# EAGLE design powerBoard_v4 (EAGLE 6.6.0)
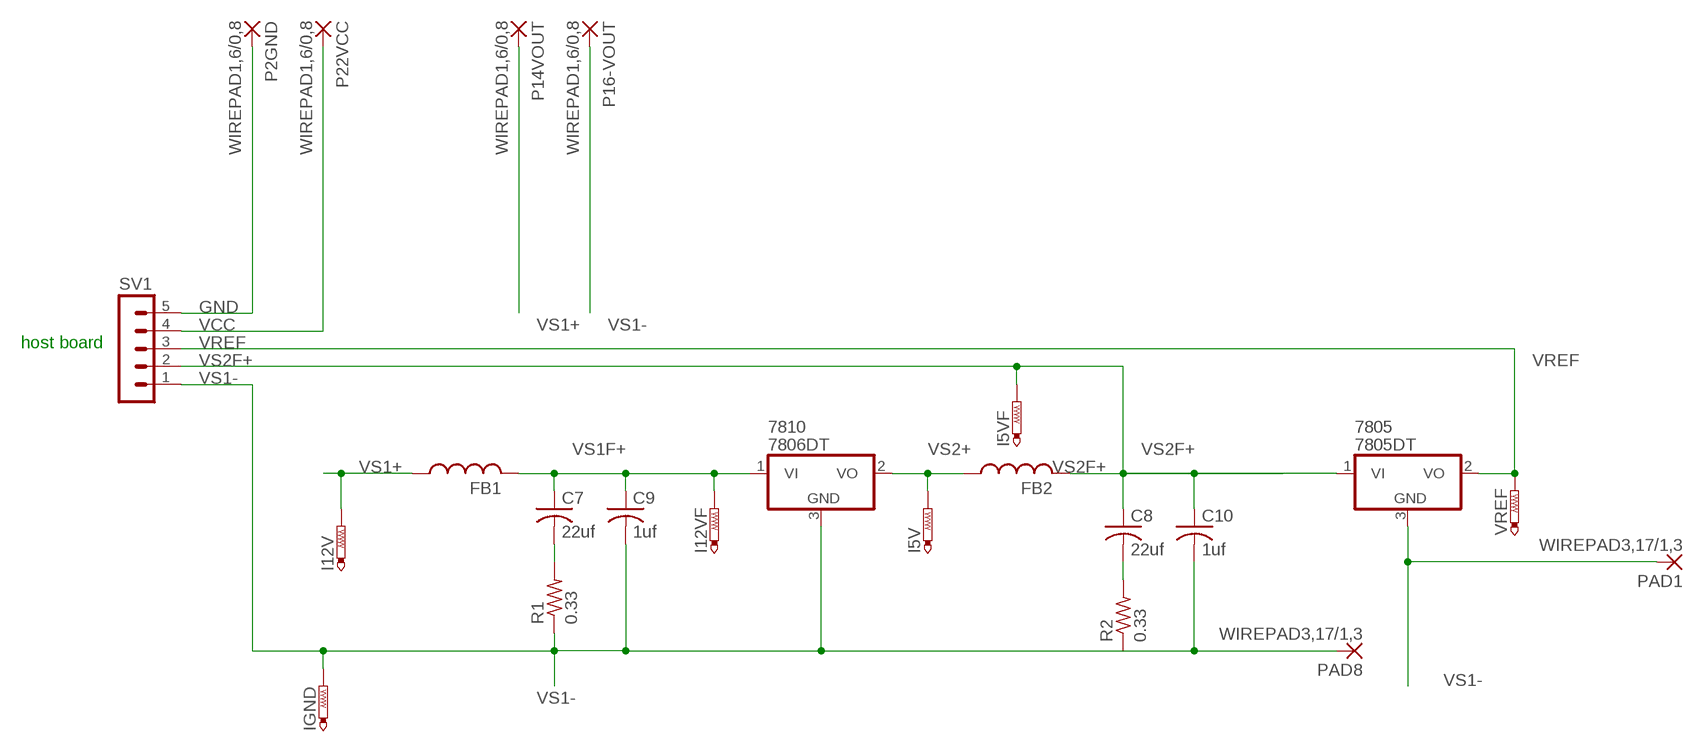
[diagram p0: schematic, sheet 1]

## Parts
7805  7805DT  [TO252]
7810  7806DT  [TO252]
C7  22uf  C-USC0805K  [C0805K]
C8  22uf  C-USC0805K  [C0805K]
C9  1uf  C-USC0805K  [C0805K]
C10  1uf  C-USC0805K  [C0805K]
FB1  L-USL2012C  [L2012C]
FB2  L-USL2012C  [L2012C]
I5V  PTR1PAD1-13  [P1-13]
I5VF  PTR1PAD1-13  [P1-13]
I12V  PTR1PAD1-13  [P1-13]
I12VF  PTR1PAD1-13  [P1-13]
IGND  PTR1PAD1-13  [P1-13]
P2GND  WIREPAD1,6/0,8  [1,6/0,8]
P14VOUT  WIREPAD1,6/0,8  [1,6/0,8]
P16-VOUT  WIREPAD1,6/0,8  [1,6/0,8]
P22VCC  WIREPAD1,6/0,8  [1,6/0,8]
PAD1  WIREPAD3,17/1,3  [3,17/1,3]
PAD8  WIREPAD3,17/1,3  [3,17/1,3]
R1  0.33  R-US_R2012W  [R2012W]
R2  0.33  R-US_R2012W  [R2012W]
SV1  MA05-1  [MA05-1]
VREF  PTR1PAD1-13  [P1-13]

## Nets
GND: P2GND.1(P) SV1.5
N$3: C8.2 R2.2
N$4: C7.2 R1.2
VCC: P22VCC.1(P) SV1.4
VREF: 7805.2(VO) SV1.3 VREF.TP
VS1+: FB1.1 I12V.TP P14VOUT.1(P)
VS1-: 7805.3(GND) 7810.3(GND) C9.2 C10.2 IGND.TP P16-VOUT.1(P) PAD1.1(P) PAD8.1(P) R1.1 SV1.1
VS1F+: 7810.1(VI) C7.1 C9.1 FB1.2 I12VF.TP
VS2+: 7810.2(VO) FB2.1 I5V.TP
VS2F+: 7805.1(VI) C8.1 C10.1 FB2.2 I5VF.TP SV1.2
Unconnected: R2.1

## Notes on the sheet
- host board

## Library data of the parts
7805 7810 = linear:78*: Positive VOLTAGE REGULATOR Source: http://cache.national.com/ds/LM/LM78L05.pdf http://www.fairchildsemi.com/ds/LM/LM7805.pdf
C7-C10 = rcl:C-US: CAPACITOR, American symbol
FB1 FB2 = rcl:L-US: INDUCTOR, American symbol
I5V I5VF I12V I12VF IGND VREF = testpad:PTR1: TEST PIN
P2GND P14VOUT P16-VOUT P22VCC PAD1 PAD8 = wirepad:WIREPAD: Wire PAD connect wire on PCB
R1 R2 = resistor:R-US_: RESISTOR, American symbol
SV1 = con-lstb:MA05-1: PIN HEADER; OC_FARNELL: unknown; OC_NEWARK: unknown

## Board
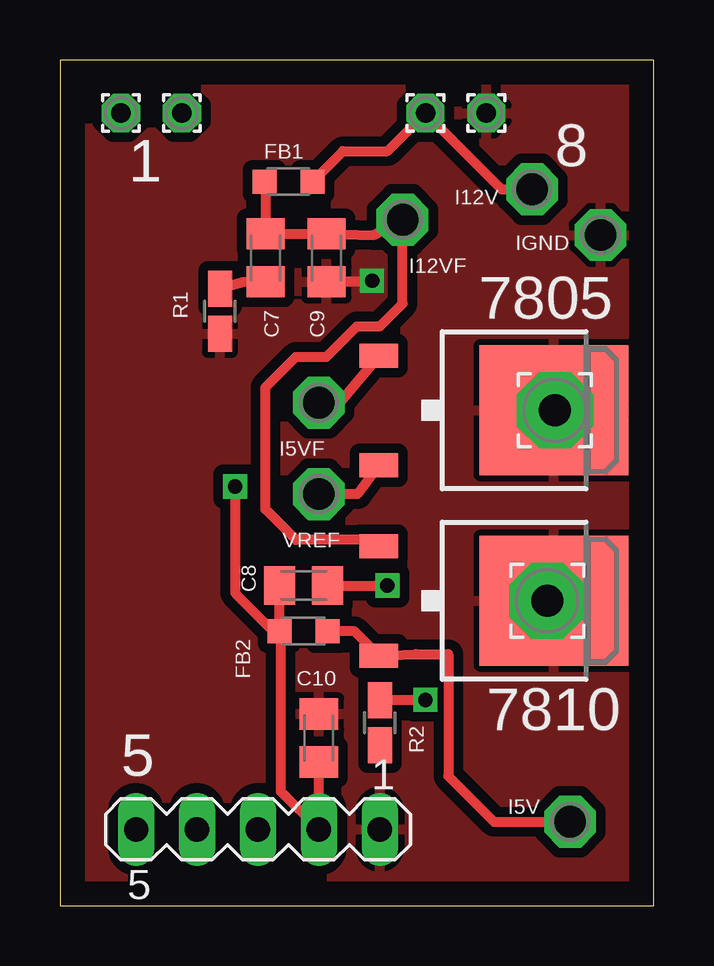
[diagram p1: board, top side]
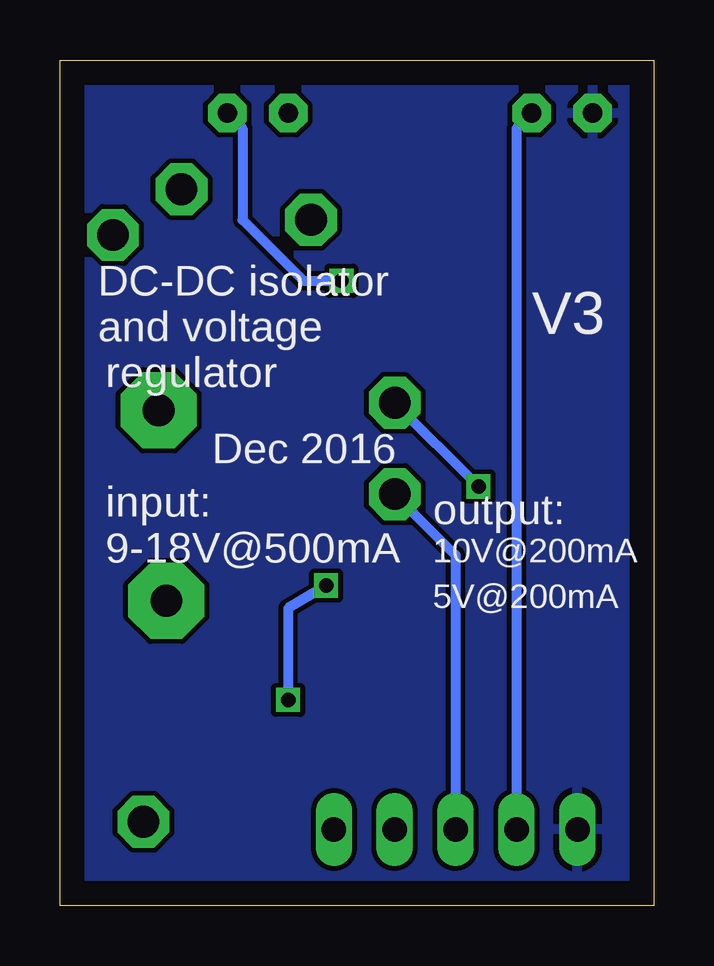
[diagram p2: board, bottom side, seen from below]

Size 24.75 x 35.23 mm. Coordinates in mm from the lower left corner, seen from the top.
Outline: 0,0 24.75,0 24.75,35.23 0,35.23 0,0
Copper layers (1*16): Top 0.035mm / dielectric 1.5mm / Bottom 0.035mm
Design rules "default *": minimum track width 10mil, minimum drill 10mil, track to track 8mil, track to pad 8mil, pad to pad 8mil, via to via 8mil, smd to smd 8mil, copper to edge 40mil, drill to drill 8mil, minimum pad ring 10mil, minimum via ring 8mil, stop-mask expansion 4mil, vias tented up to drill 0mil, thermal gap 10mil

### Footprints (pad centres in the part's own frame; a part is rotated, then mirrored left to right if it is on the bottom)
TO252 = smd 1 x 1.6: 1 -2.28,-4.8; 2 2.28,-4.8 | smd 5.4 x 6.2: 3 0,2.5
C0805K = smd 1.3 x 1.6: 1 -1,0; 2 1,0
L2012C = smd 1 x 1: 1 -1,0; 2 1,0
P1-13 = drill 1.321 pad 2.159 octagon: TP 0,0
1,6/0,8 = drill 0.813 pad 1.6 octagon: 1 0,0
3,17/1,3 = drill 1.321 pad 3.175 octagon: 1 0,0
R2012W = smd 1.5 x 1: 1 -0.94,0; 2 0.94,0
MA05-1 = drill 1.016 long: 1 -5.08,0; 2 -2.54,0; 3 0,0; 4 2.54,0; 5 5.08,0

### Placement (x,y rotation side)
7805  18.1,20.64 270 top
7810  18.1,12.7 270 top
C7  8.57,26.99 270 top
C8  10.16,13.34 0 top
C9  11.11,26.99 270 top
C10  10.79,6.99 90 top
FB1  9.53,30.16 180 top
FB2  10.16,11.43 180 top
I5V  21.27,3.49 0 top
I5VF  10.79,20.95 0 top
I12V  19.68,29.84 0 top
I12VF  14.29,28.57 0 top
IGND  22.54,27.94 0 top
P2GND  2.54,33.02 0 top
P14VOUT  15.24,33.02 0 top
P16-VOUT  17.78,33.02 0 top
P22VCC  5.08,33.02 0 top
PAD1  20.64,20.64 0 top
PAD8  20.32,12.7 0 top
R1  6.67,24.77 90 top
R2  13.34,7.62 90 top
SV1  8.26,3.17 180 top
VREF  10.79,17.14 0 top

### Tracks (layer width: path | path; a pad name or v marks a point on that pad's centre or on a via)
GND
  pour Bottom: 0,35.24 24.77,35.24 24.77,0 0,0
N$3  (via drill 0.6)
  Top 0.406: C8.2 v13.65,13.34 | v15.24,8.57 15.23,8.56 R2.2
  Bottom 0.406: v13.65,13.34 15.24,12.38 v15.24,8.57
N$4
  Top 0.406: C7.2 7.63,25.98 R1.2
VCC
  Bottom 0.406: P22VCC.1 5.71,32.38 SV1.4
VREF
  Top 0.406: 7805.2 12.4,17.14 VREF.TP
  Bottom 0.406: VREF.TP 8.26,14.61 SV1.3
VS1+
  Top 0.406: I12V.TP 18.41,29.84 P14VOUT.1 13.65,31.43 11.79,31.43 FB1.1
VS1-  (via drill 0.6)
  Top 0.406: v13.02,26.04 12.97,25.99 C9.2
  Bottom 0.406: P16-VOUT.1 17.14,32.38 17.14,28.57 14.61,26.04 v13.02,26.04
  pour Top (isolate 0.406): 0,0 24.77,0 24.77,35.24 0,35.24
VS1F+
  Top 0.406: 7810.1 13.56,15.24 9.84,15.24 8.57,16.51 8.57,21.59 9.84,22.86 11.11,22.86 12.38,24.13 13.34,24.13 14.29,25.08 I12VF.TP 13.06,27.94 C9.1 C7.1 8.57,30.11 FB1.2
VS2+
  Top 0.406: FB2.1 12.29,11.43 7810.2 14.83,10.48 16.19,10.48 16.19,5.4 18.1,3.49 I5V.TP
VS2F+  (via drill 0.6)
  Top 0.406: C10.1 SV1.2 9.21,4.76 9.21,11.11 | C8.1 FB2.2 9.16,11.38 9.21,11.11 | 7805.1 11.65,20.95 I5VF.TP | v7.3,17.46 7.3,13.02 9.21,11.11
  Bottom 0.406: I5VF.TP v7.3,17.46

### Text on the board
tNames: 8 | 1 | 7805 | 7810 | 5
bNames: DC-DC isolator | V3 | and voltage | regulator | Dec 2016 | output: | 10V@200mA | input: / 9-18V@500mA | 5V@200mA
tValues: 1